# EAGLE schematic tlc5940_tranzisztor (EAGLE 6.6.0)
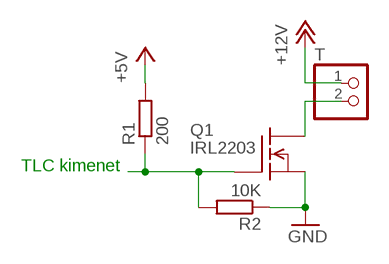
[diagram p0: schematic, sheet 1]

## Parts
Q1  IRL2203  BUZ10  [TO220]
R1  200  R-EU_0207/10  [0207/10]
R2  10K  R-EU_0207/10  [0207/10]
T  PINHD-1X2  [1X02]

## Nets
+5V: R1.2
+12V: T.1
GND: Q1.3(S) R2.1
N$1: Q1.1(G) R1.1 R2.2
N$2: Q1.2(D) T.2

## Notes on the sheet
- TLC kimenet

## Library data of the parts
Q1 = transistor-fet:BUZ10: N-Channel Enhancement MOSFET 50V; 20A; 0,080Ohm
R1 R2 = rcl:R-EU_: RESISTOR, European symbol
T = pinhead:PINHD-1X2: PIN HEADER